# Altium schematic sheet TankNode-SchDoc.SchDoc
size 431 x 279 mm; SheetNumber: 1; SheetTotal: 4
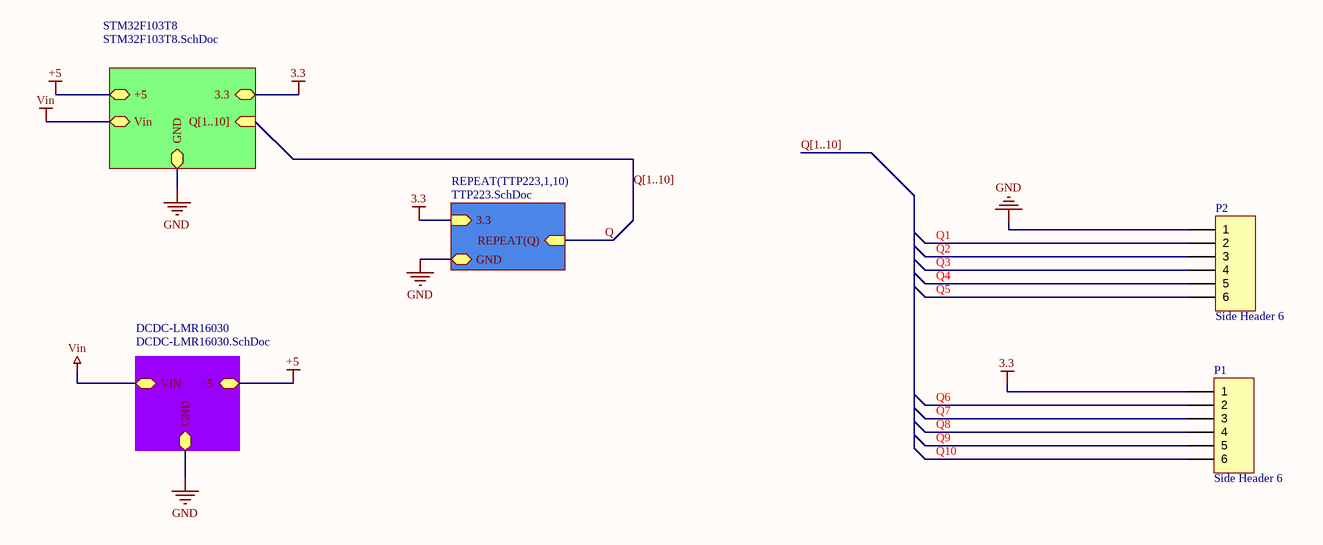
[diagram p0: TankNode-SchDoc.SchDoc]

## Parts
P1  Side Header 6  [6pin 1.5pitch]
P2  Side Header 6  [6pin 1.5pitch]

## Sub-sheets
DCDC-LMR16030 = DCDC-LMR16030.SchDoc: GND (bidir), VIN (bidir), +5 (bidir)
REPEAT(TTP223,1,10) = TTP223.SchDoc: GND (bidir), 3.3 (in), REPEAT(Q) (in)
STM32F103T8 = STM32F103T8.SchDoc: GND (bidir), +5 (bidir), 3.3 (bidir), Vin (bidir), Q[1..10] (in)

## Nets
3.3: P1.1 ; sheet STM32F103T8/3.3, sheet REPEAT(TTP223,1,10)/3.3
+5: sheet DCDC-LMR16030/+5, sheet STM32F103T8/+5
GND: P2.1 ; sheet DCDC-LMR16030/GND, sheet STM32F103T8/GND, sheet REPEAT(TTP223,1,10)/GND
Vin: sheet DCDC-LMR16030/VIN, sheet STM32F103T8/Vin
Q: sheet REPEAT(TTP223,1,10)/REPEAT(Q)
Q1: P2.2
Q2: P2.3
Q3: P2.4
Q4: P2.5
Q5: P2.6
Q6: P1.2
Q7: P1.3
Q8: P1.4
Q9: P1.5
Q10: P1.6

## Buses and harness runs
bus Q[1..10]
bus Q[1..10] = sheet STM32F103T8/Q[1..10]

## Notes on the sheet
- DWG. NO.
- REV.
- SHT.
- THIS DOCUMENT AND THE DATA DISCLOSED HEREIN OR HEREWITH IS THE PROPERTY OF ALTIUM LIMITED AND MAY BE FREELY DISTRIBUTED IN WHOLE. NO RIGHTS ARE RESERVED OR EXPRESS OR IMPLIED WARANTEE GIVEN.
- REVISION
- DESCRIPTION
- DATE
- APPROVED
- ENG:
- APPROVALS
- PROJECT
- DSN:
- CHK:
- REFERENCE DOCUMENTS
- PROJECT REVISION:
- TITLE
- DOCUMENT REVISION:
- DESIGN ITEM:
- BOM:
- FAB DWG:
- PCB DWG:
- ASSY DWG:
- SCALE:
- SIZE
- B
- CAGE CODE
- FILE NAME
- DWG NO.
- SHEET
- OF
- REV

## Library data of the parts
P1 P2 = Side Header 6: Header, 4-Pin; LatestRevisionDate: 17-Jul-2002; LatestRevisionNote: Re-released for DXP Platform.; Publisher: Altium Limited